# Altium project 18112C_Ticketing.PrjPcb
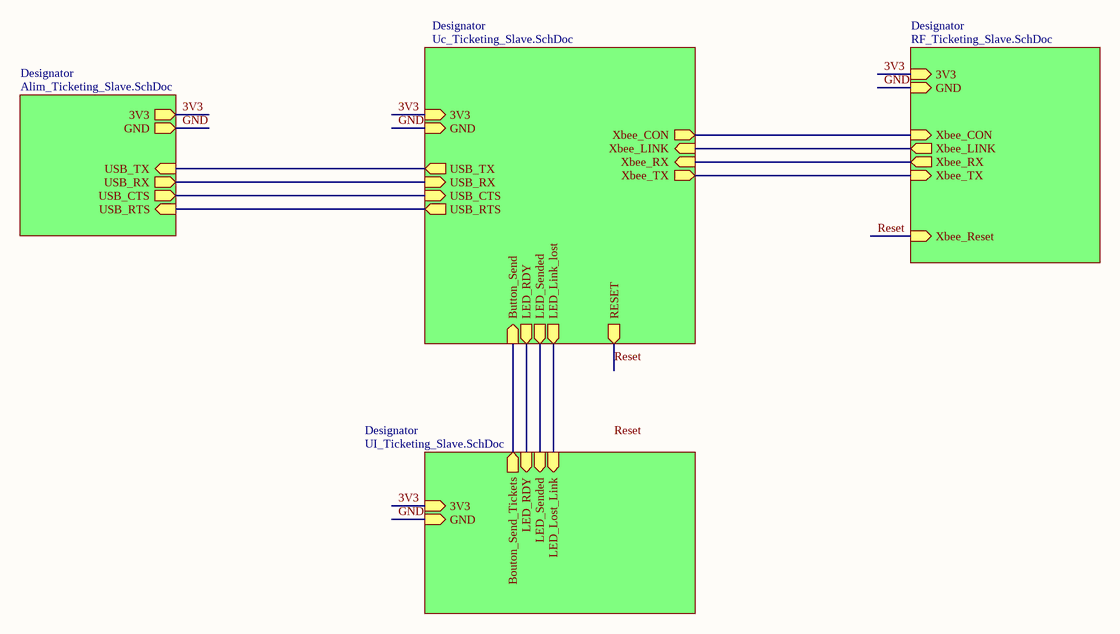
[diagram p0: Ticketing_Slave.SchDoc]
5 sheets, 49 parts. Net scope: hierarchical (ports join the sheet entries above them; power ports are global).
Board file: PCB_Ticketing_Slave_QFN.PcbDoc
Sheets:
  Ticketing_Slave.SchDoc
    Designator = Uc_Ticketing_Slave.SchDoc
    Designator = RF_Ticketing_Slave.SchDoc
    Designator = UI_Ticketing_Slave.SchDoc
    Designator = Alim_Ticketing_Slave.SchDoc

## Sheet Ticketing_Slave.SchDoc
size A4; Author: Mario Dos Santos; Organization: ETML-ES; Address1: Avenue Recordon 1; Address2: 1004 Lausanne; Address3: Switzerland; Revision: C; SheetNumber: 1; SheetTotal: 5

### Sub-sheets
Designator = Uc_Ticketing_Slave.SchDoc: 3V3 (in), GND (in), Xbee_CON (out), Xbee_LINK (in), Xbee_RX (in), Xbee_TX (out), Button_Send (in), LED_Link_lost (out), LED_Sended (out), LED_RDY (out), RESET (out), USB_TX (out), USB_RX (in), USB_CTS (in), USB_RTS (out)
Designator = RF_Ticketing_Slave.SchDoc: GND (in), Xbee_Reset (in), Xbee_CON (in), 3V3 (in), Xbee_LINK (out), Xbee_RX (out), Xbee_TX (in)
Designator = UI_Ticketing_Slave.SchDoc: 3V3 (in), GND (in), LED_RDY (in), LED_Sended (in), LED_Lost_Link (in), Bouton_Send_Tickets (out)
Designator = Alim_Ticketing_Slave.SchDoc: GND (out), 3V3 (out), USB_TX (in), USB_RX (out), USB_CTS (out), USB_RTS (in)

### Nets
3V3: sheet Designator/3V3, sheet Designator/GND, sheet Designator/LED_RDY, sheet Designator/RESET, sheet Designator/GND, sheet Designator/Xbee_Reset, sheet Designator/3V3, sheet Designator/3V3, sheet Designator/GND, sheet Designator/LED_RDY, sheet Designator/GND, sheet Designator/3V3  [also labelled GND, Reset]
Connect(M): sheet Designator/Xbee_TX, sheet Designator/Xbee_TX
LED_Lost: sheet Designator/Button_Send, sheet Designator/Bouton_Send_Tickets
LED_Send: sheet Designator/LED_Link_lost, sheet Designator/LED_Lost_Link
LINK(M): sheet Designator/Xbee_RX, sheet Designator/Xbee_RX
Reset: sheet Designator/LED_Sended, sheet Designator/LED_Sended
Reset(M): sheet Designator/Xbee_LINK, sheet Designator/Xbee_LINK
USB_CTS: sheet Designator/USB_CTS, sheet Designator/USB_CTS
USB_CTS: sheet Designator/USB_RTS, sheet Designator/USB_RTS  [a separate net that carries the same name]
USB_RX: sheet Designator/USB_RX, sheet Designator/USB_RX
USB_TX: sheet Designator/USB_TX, sheet Designator/USB_TX
Xbee_RX: sheet Designator/Xbee_CON, sheet Designator/Xbee_CON

### Notes on the sheet
- Labels drawn without touching a wire or pin: Reset
- Fichier :
- a
- Date :
- Heure :
- Version :
- Auteur :
- Modif.
- b
- c
- d
- Projet :
- No :
- Nb feuilles
- Feuille n°
- Chemin :

## Sheet Uc_Ticketing_Slave.SchDoc
size A4; Author: Mario Dos Santos; Organization: ETML-ES; Address1: Avenue Recordon 1; Address2: 1004 Lausanne; Address3: Switzerland; SheetNumber: 3; SheetTotal: 5
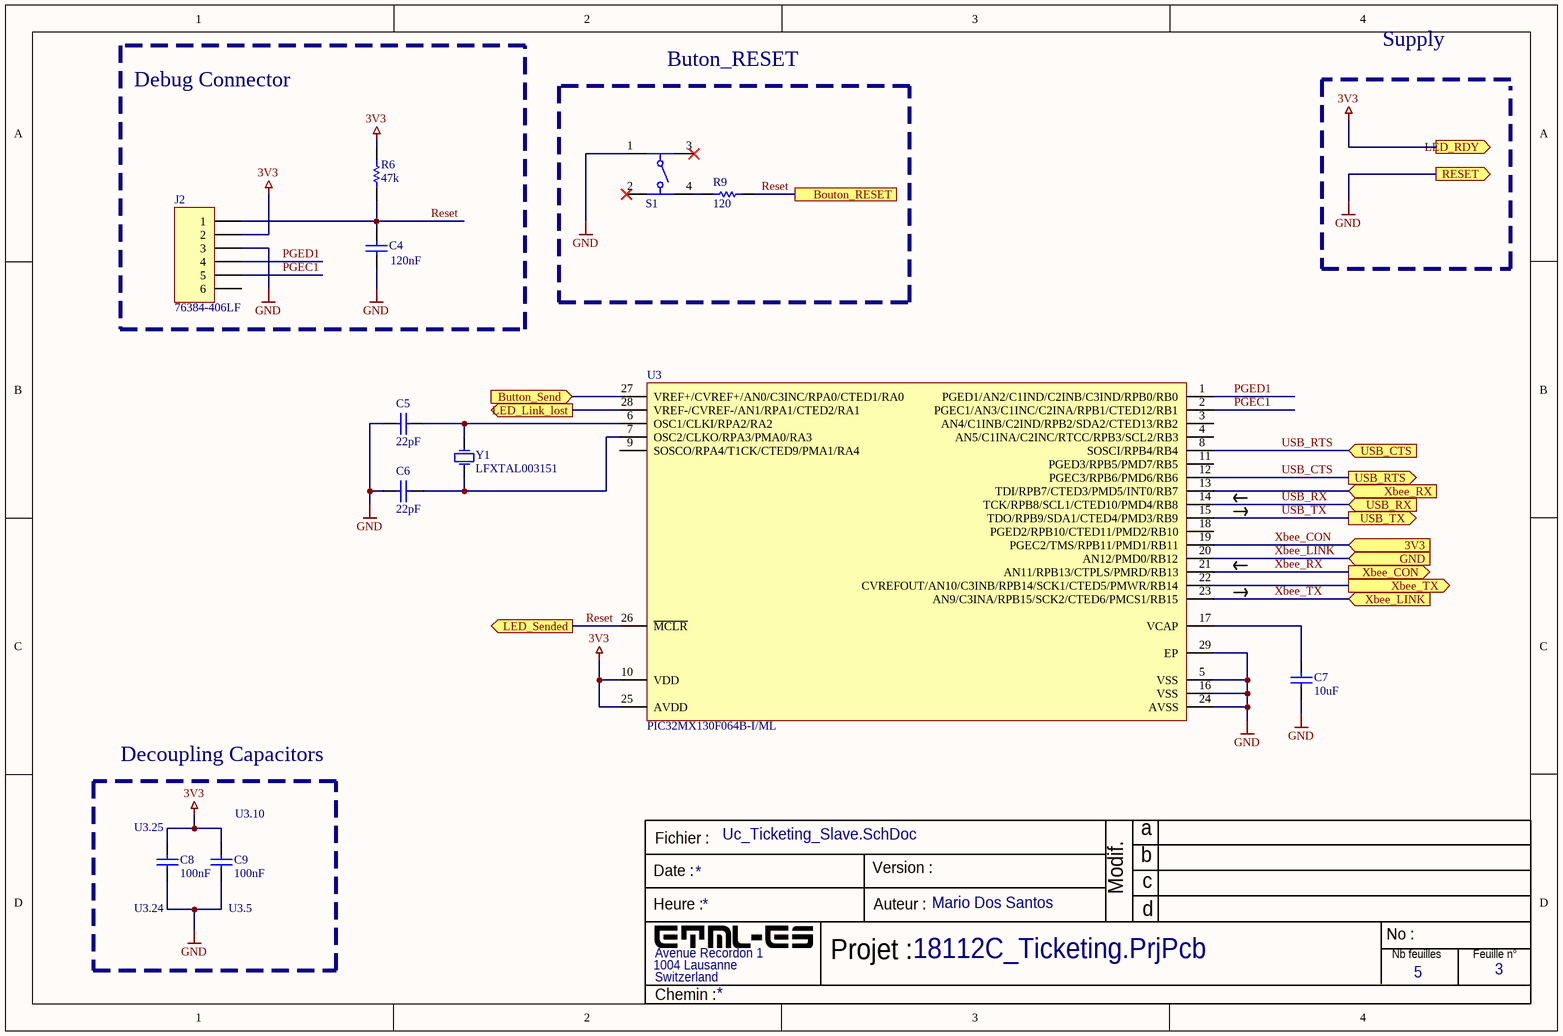
[diagram p1: Uc_Ticketing_Slave.SchDoc]

### Parts
C4  120nF  [6-0805_N]
C5  22pF  [6-0805_N]
C6  22pF  [6-0805_N]
C7  10uF  [6-0805_N]
C8  100nF  [6-0805_N]
C9  100nF  [6-0805_N]
J2  76384-406LF  [76384-406LF]
R6  47k  [RESC0805(2012)_L]
R9  120  [RESC0805(2012)_L]
S1  430182050816  [430182050816]  (value not drawn)
U3  PIC32MX130F064B-I/ML  [MCHP-QFN-ML28_L]
Y1  LFXTAL003151  [LFXTAL003151REEL]

### Blocks framed on the sheet
Debug Connector: C4 J2 R6
Buton_RESET: R9 S1
Decoupling Capacitors: C8 C9

### Ports
3V3 (in), Bouton_RESET, Button_Send (in), GND (in), LED_Link_lost (out), LED_RDY (out), LED_Sended (out), RESET (out), USB_CTS (in), USB_RTS (out), USB_RX (in), USB_TX (out), Xbee_CON (out), Xbee_LINK (in), Xbee_RX (in), Xbee_TX (out)

### Nets
3V3: C4.1 C5.1 C6.1 C7.1 C8.1 C8.2 C9.1 C9.2 J2.2 J2.3 R6.1 S1.1 U3.5(VSS) U3.10(VDD) U3.16(VSS) U3.19(PGEC2/TMS/RPB11/PMD1/RB11) U3.20(AN12/PMD0/RB12) U3.24(AVSS) U3.25(AVDD) U3.29(EP) ; port 3V3, port GND, port LED_RDY, port RESET  [also labelled GND, Xbee_CON, Xbee_LINK]
Connect(M): U3.22(CVREFOUT/AN10/C3INB/RPB14/SCK1/CTED5/PMWR/RB14) ; port Xbee_TX
LED_Lost: U3.27(VREF+/CVREF+/AN0/C3INC/RPA0/CTED1/RA0) ; port Button_Send
LED_Send: U3.28(VREF-/CVREF-/AN1/RPA1/CTED2/RA1) ; port LED_Link_lost
LINK(M): U3.13(TDI/RPB7/CTED3/PMD5/INT0/RB7) ; port Xbee_RX
PGEC1: J2.5 U3.2(PGEC1/AN3/C1INC/C2INA/RPB1/CTED12/RB1)
PGED1: J2.4 U3.1(PGED1/AN2/C1IND/C2INB/C3IND/RPB0/RB0)
Reset: C4.2 J2.1 R6.2 R9.2 U3.26(~{MCLR}) ; port LED_Sended, port Bouton_RESET
USB_CTS: U3.12(PGEC3/RPB6/PMD6/RB6) ; port USB_RTS
USB_RTS: U3.8(SOSCI/RPB4/RB4) ; port USB_CTS  [project net USB_CTS]
USB_RX: U3.14(TCK/RPB8/SCL1/CTED10/PMD4/RB8) ; port USB_RX
USB_TX: U3.15(TDO/RPB9/SDA1/CTED4/PMD3/RB9) ; port USB_TX
Xbee_RX: U3.21(AN11/RPB13/CTPLS/PMRD/RB13) ; port Xbee_CON
Xbee_TX: U3.23(AN9/C3INA/RPB15/SCK2/CTED6/PMCS1/RB15) ; port Xbee_LINK  [project net Reset(M)]
NetC5_2: C5.2 U3.6(OSC1/CLKI/RPA2/RA2) Y1.1
NetC6_2: C6.2 U3.7(OSC2/CLKO/RPA3/PMA0/RA3) Y1.2
NetC7_2: C7.2 U3.17(VCAP)
NetR9_1: R9.1 S1.4

Not connected (* = marked no-connect by the designer): J2 6; S1 2* 3*; U3 3(AN4/C1INB/C2IND/RPB2/SDA2/CTED13/RB2) 4(AN5/C1INA/C2INC/RTCC/RPB3/SCL2/RB3) 9(SOSCO/RPA4/T1CK/CTED9/PMA1/RA4) 11(PGED3/RPB5/PMD7/RB5) 18(PGED2/RPB10/CTED11/PMD2/RB10)

### Notes on the sheet
- Supply
- (near C8) U3.25
- (near C9) U3.10
- (near C8) U3.24
- (near C9) U3.5
- Fichier :
- a
- Date :
- Heure :
- Version :
- Auteur :
- Modif.
- b
- c
- d
- Projet :
- No :
- Nb feuilles
- Feuille n°
- Chemin :

### Library data of the parts
C4 C7-C9 = Cap: Capacitor; Supplier: Digi-Key
  C4: Value: 120nF; Supplier Part Number: 311-4323-1-ND; Supplier unit price: 0.18
  C7: Value: 10uF; Supplier Part Number: 1276-1298-1-ND; Supplier unit price: 0.1
  C8 C9: Value: 100nF; Supplier Part Number: 399-C0805C104M5RAC7800CT-ND; Supplier unit price: 0.1
C5 C6 = CMP-2007-03167-1: VJ0805Y104KNAAT; Supplier: Digi-Key; Supplier Part Number: 399-C0805C220J5GAC7800CT-ND; Supplier unit price: 0.1; Value: 22pF
J2 = Header 6: Header, 6-Pin; LatestRevisionDate: 17-Jul-2002; LatestRevisionNote: Re-released for DXP Platform.; Publisher: Altium Limited; Supplier 1: Digi-Key; Supplier Part Number 1: 609-1321-ND; Supplier unit price: 0.66; Value: 76384-406LF
R6 = CMP-1013-00122-1: 100K 0.125W 5% 0805 (2012 Metric)  SMD; Value: 47k; Supplier: Digi-Key; Supplier Part Number: A130144CT-ND; Supplier unit price: 0.1
R9 = CMP-1013-00122-1: 100K 0.125W 5% 0805 (2012 Metric)  SMD; Value: 10k; Supplier: Digi-Key; Supplier Part Number: A129738CT-ND; Supplier unit price: 0.1
S1 = 430182050816: 6x6mm SMD Tact Switch WS-TASV, height 5 mm, 160 gf; Supplier: Digi-Key; Supplier Part Number: 732-7005-1-ND; Supplier unit price: 0.51; Value: 430182050816
U3 = CMP-0048-00437-1: 32-bit Microcontroller with Audio and Graphics Interface, USB and Advanced Analog, 40 MHz, 21 I/O, PMP, -40 to 85 degC, 28-pin QFN (ML28), Tube; Supplier: Digi-Key; Supplier Part Number: PIC32MX130F064B-I/ML; Supplier unit price: 3.61; Value: PIC32MX130F064B-I/ML
Y1 = LFXTAL003151REEL: Crystal or Oscillator; Frequency: 8MHz; Supplier: Farnell; Supplier Part Number: 9713794; Supplier unit price: 0.392; Value: LFXTAL003151

## Sheet RF_Ticketing_Slave.SchDoc
size A4; Author: Mario Dos Santos; Organization: ETML-ES; Address1: Avenue Recordon 1; Address2: 1004 Lausanne; Address3: Switzerland; SheetNumber: 5; SheetTotal: 5
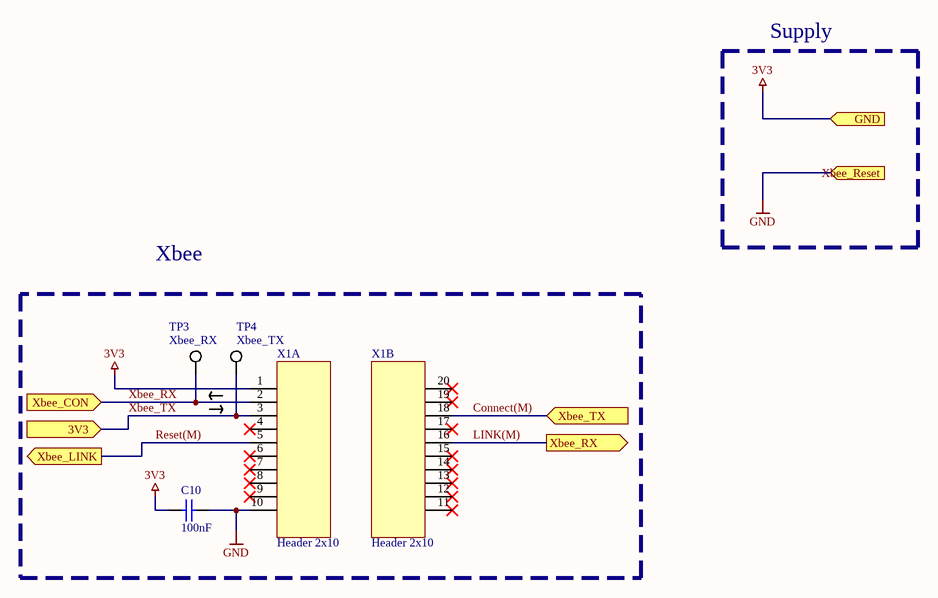
[diagram p2: RF_Ticketing_Slave.SchDoc]

### Parts
C10  100nF  [6-0805_N]
TP3  value Xbee_RX  [KSTN-5019_V]
TP4  value Xbee_TX  [KSTN-5019_V]
X1  Header 2x10  [ZB-SB]  (parts A,B of 2)

### Ports
3V3 (in), GND (in), Xbee_CON (in), Xbee_LINK (out), Xbee_Reset (in), Xbee_RX (out), Xbee_TX (in)

### Nets
3V3: C10.1 C10.2 TP4.1 X1.1 X1.3 X1.10 ; port GND, port Xbee_Reset, port 3V3  [also labelled GND, Xbee_TX]
Connect(M): X1.18 ; port Xbee_TX
LINK(M): X1.16 ; port Xbee_RX
Reset(M): X1.5 ; port Xbee_LINK
Xbee_RX: TP3.1 X1.2 ; port Xbee_CON

Not connected (* = marked no-connect by the designer): X1 4* 6* 7* 8* 9* 11* 12* 13* 14* 15* 17* 19* 20*

### Notes on the sheet
- Supply
- Xbee
- Fichier :
- a
- Date :
- Heure :
- Version :
- Auteur :
- Modif.
- b
- c
- d
- Projet :
- No :
- Nb feuilles
- Feuille n°
- Chemin :

### Library data of the parts
C10 = Cap_1: Capacitor; Value: 100nF; Supplier: Digi-Key; Supplier Part Number: 399-C0805C104M5RAC7800CT-ND; Supplier unit price: 0.1
TP3 TP4 = CMP-1672-00008-1: Test Point, 1 Position SMD, RoHS, Tape and Reel; Supplier: Digi-Key; Supplier Part Number: 36-5019CT-ND; Supplier unit price: 0.33
X1 = HDR ZB-SB 2x10_1: Header 2x10 / Xbee de letml(1623) ou xbee XB24CAUIT-001; Value: Header 2x10; Supplier: Digi-Key

## Sheet UI_Ticketing_Slave.SchDoc
size A4; Author: Mario Dos Santos; Organization: ETML-ES; Address1: Avenue Recordon 1; Address2: 1004 Lausanne; Address3: Switzerland; SheetNumber: 4; SheetTotal: 5
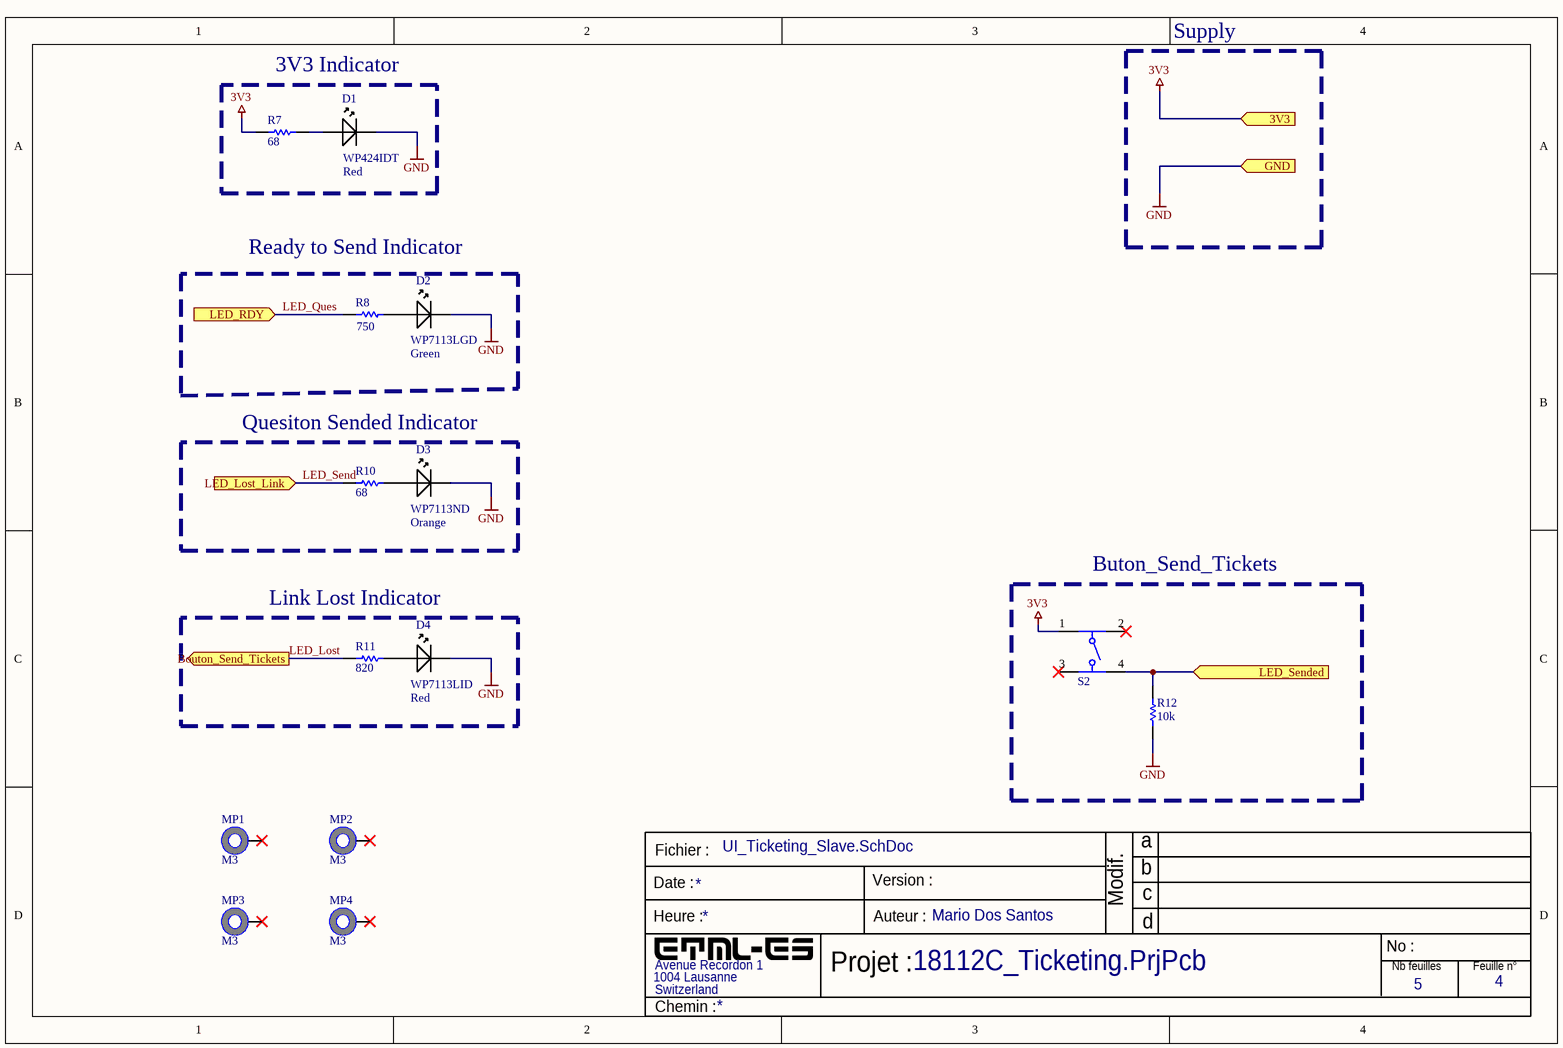
[diagram p3: UI_Ticketing_Slave.SchDoc]

### Parts
D1  WP424IDT  Color: Red  [LED-2P-2.28-3MM]
D2  WP7113LGD  Color: Green  [Type 5mm]
D3  WP7113ND  Color: Orange  [Type 5mm]
D4  WP7113LID  Color: Red  [Type 5mm]
MP1  M3  [9774010151]
MP2  M3  [9774010151]
MP3  M3  [9774010151]
MP4  M3  [9774010151]
R7  68  [RESC0805(2012)_L]
R8  750  [RESC0805(2012)_L]
R10  68  [RESC0805(2012)_L]
R11  820  [RESC0805(2012)_L]
R12  10k  [RESC0805(2012)_L]
S2  430466073726  [4304x60737x6_12x12x7.3]  (value not drawn)

### Blocks framed on the sheet
3V3 Indicator: D1 R7
Ready to Send Indicator: D2 R8
Quesiton Sended Indicator: D3 R10
Link Lost Indicator: D4 R11
Buton_Send_Tickets: R12 S2

### Ports
3V3 (in), Bouton_Send_Tickets (out), GND (in), LED_Lost_Link (in), LED_RDY (in), LED_Sended (in)

### Nets
3V3: D1.2(Cathode) D2.1(Cathode) D3.1(Cathode) D4.1(Cathode) R7.2 R8.2 R12.2 S2.1 ; port 3V3, port GND, port LED_RDY  [also labelled GND, LED_Ques]
LED_Lost: R11.2 ; port Bouton_Send_Tickets
LED_Send: R10.2 ; port LED_Lost_Link
Reset: R12.1 S2.4 ; port LED_Sended
NetD1_1: D1.1(Anode) R7.1
NetD2_2: D2.2(Anode) R8.1
NetD3_2: D3.2(Anode) R10.1
NetD4_2: D4.2(Anode) R11.1

Not connected (* = marked no-connect by the designer): MP1 1*; MP2 1*; MP3 1*; MP4 1*; S2 2* 3*

### Notes on the sheet
- Supply
- Fichier :
- a
- Date :
- Heure :
- Version :
- Auteur :
- Modif.
- b
- c
- d
- Projet :
- No :
- Nb feuilles
- Feuille n°
- Chemin :

### Library data of the parts
D1-D4 = LED: Supplier: Digi-Key
  D1: Supplier Part Number: 754-1305-ND; Supplier unit price: 0.4; Value: WP424IDT
  D2: Supplier Part Number: 754-1265-ND; Supplier unit price: 0.33; Value: WP7113LGD
  D3: Supplier Part Number: 754-1896-ND; Supplier unit price: 0.3; Value: WP7113ND
  D4: Supplier Part Number: 754-1266-ND; Supplier unit price: 0.33; Value: WP7113LID
MP1-MP4 = 9774010151: WA-SMSI SMT Steel Spacer, M2.5 Thread Internal, Length 1mm; Supplier: Digi-Key
R7 R8 R12 = CMP-1013-00122-1: 100K 0.125W 5% 0805 (2012 Metric)  SMD; Supplier: Digi-Key; Supplier unit price: 0.1
  R7: Value: 68; Supplier Part Number: RMCF0805JT68R0CT-ND
  R8: Value: 750; Supplier Part Number: A126386CT-ND
  R12: Value: 10k; Supplier Part Number: 311-10KLGCT-ND
R10 R11 = CMP-1013-00122-1: 100K 0.125W 5% 0805 (2012 Metric)  SMD; Value: 680; Supplier: Digi-Key; Supplier unit price: 0.1
  R10: Supplier Part Number: RMCF0805JT68R0CT-ND
  R11: Supplier Part Number: A129748CT-ND
S2 = 430466073726: WS-TATV 12x12mm washable Tact Switch, THT version; Supplier: Digi-Key; Supplier Part Number: 430466073726-ND; Supplier unit price: 0.56; Value: 430466073726

## Sheet Alim_Ticketing_Slave.SchDoc
size A4; Author: Mario Dos Santos; Organization: ETML-ES; Address1: Avenue Recordon 1; Address2: 1004 Lausanne; Address3: Switzerland; SheetNumber: 2; SheetTotal: 5
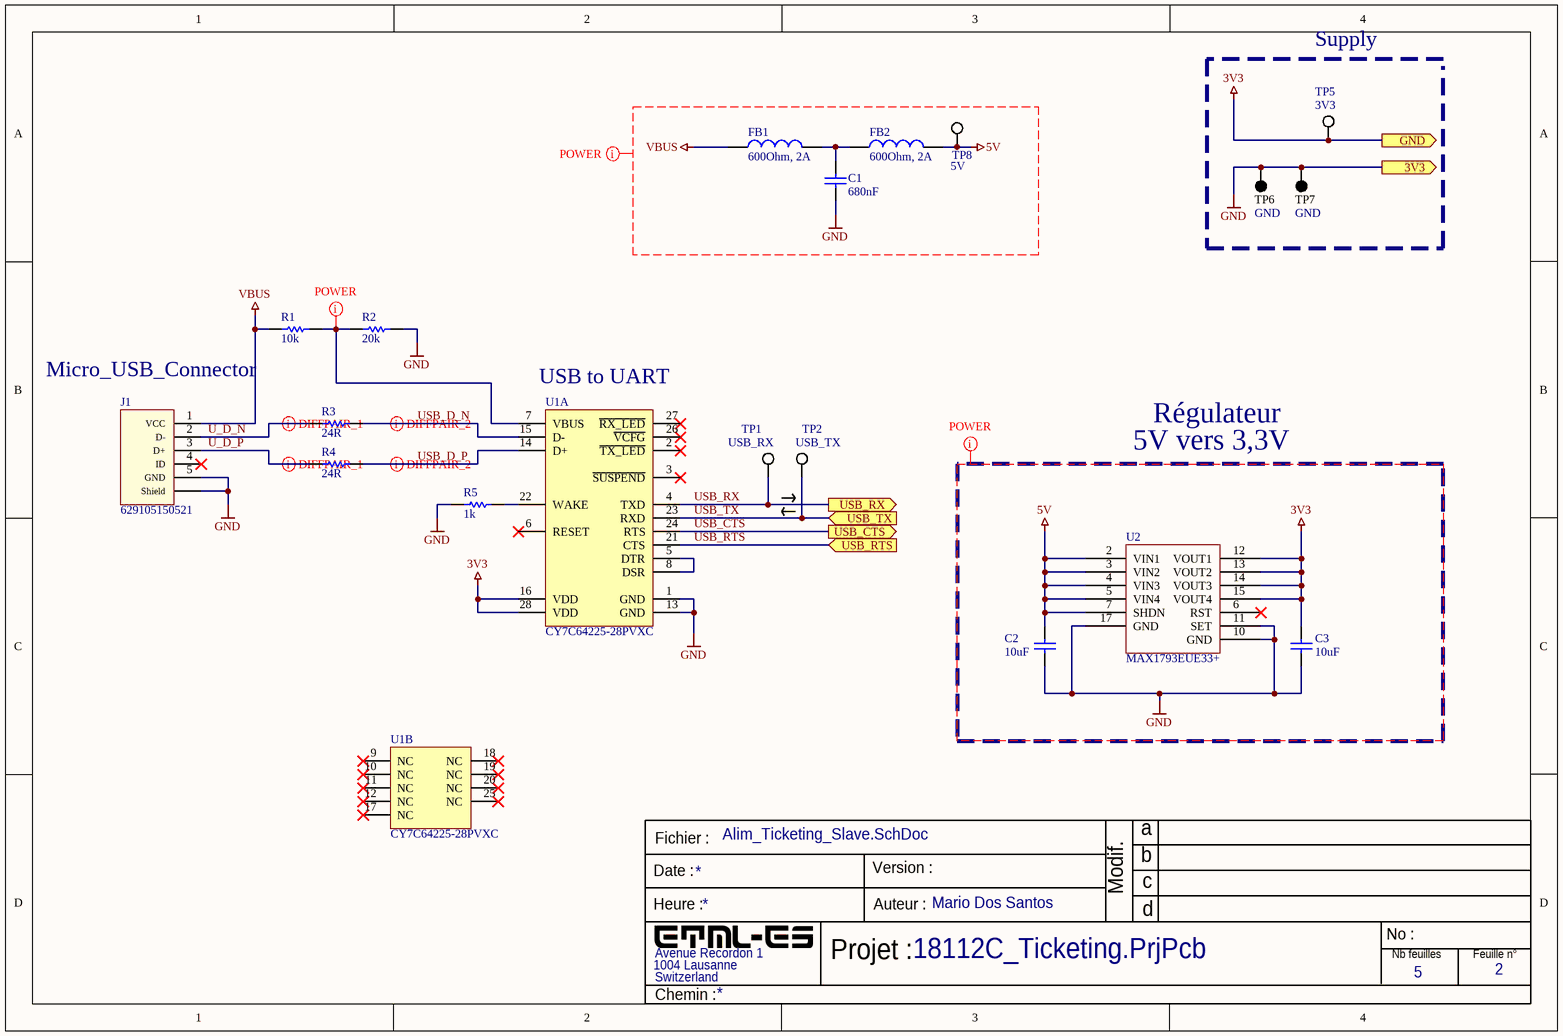
[diagram p4: Alim_Ticketing_Slave.SchDoc]

### Parts
C1  680nF  [6-0805_N]
C2  10uF  [6-0805_N]
C3  10uF  [6-0805_N]
FB1  600Ohm, 2A  [WE-CBF_0805_High Current]
FB2  600Ohm, 2A  [WE-CBF_0805_High Current]
J1  629105150521  [629105150521]
R1  10k  [RESC0805(2012)_L]
R2  20k  [RESC0805(2012)_L]
R3  24R  [RESC0805(2012)_L]
R4  24R  [RESC0805(2012)_L]
R5  1k  [RESC0805(2012)_L]
TP1  (no value)  [KSTN-5019_V]
TP2  (no value)  [KSTN-5019_V]
TP5  (no value)  [KSTN-5019_V]
TP6  (no value)  [KSTN-5011_V]
TP7  (no value)  [KSTN-5011_V]
TP8  (no value)  [KSTN-5019_V]
U1  CY7C64225-28PVXC  [CYP-PVX28_N]  (parts A,B of 2)
U2  MAX1793EUE33+  [TSOP65P640X110_HS-17N]

### Blocks framed on the sheet
5V vers 3,3V: C2 C3 U2

### Ports
3V3 (out), GND (out), USB_CTS (out), USB_RTS (in), USB_RX (out), USB_TX (in)

### Nets
3V3: C1.2 C2.2 C3.1 C3.2 J1.5(GND) J1.Shell(Shield) R2.2 R5.2 TP5.1 TP6.1 TP7.1 U1.1(GND) U1.13(GND) U1.16(VDD) U1.28(VDD) U2.10(GND) U2.11(SET) U2.12(VOUT1) U2.13(VOUT2) U2.14(VOUT3) U2.15(VOUT4) U2.17(GND) ; port GND, port 3V3  [also labelled GND]
5V: C2.1 FB2.2 TP8.1 U2.2(VIN1) U2.3(VIN2) U2.4(VIN3) U2.5(VIN4) U2.7(SHDN)
VBUS: FB1.1 J1.1(VCC) R1.1
U_D_N: J1.2(D-) R3.1
U_D_P: J1.3(D+) R4.1
USB_CTS: U1.24(RTS) ; port USB_CTS
USB_D_N: R3.2 U1.15(D-)
USB_D_P: R4.2 U1.14(D+)
USB_RTS: U1.21(CTS) ; port USB_RTS  [project net USB_CTS]
USB_RX: TP1.1 U1.4(TXD) ; port USB_RX
USB_TX: TP2.1 U1.23(RXD) ; port USB_TX
NetC1_1: C1.1 FB1.2 FB2.1
NetR1_2: R1.2 R2.1 U1.7(VBUS)
NetR5_1: R5.1 U1.22(WAKE)
NetU1_5: U1.5(DTR) U1.8(DSR)

Not connected (* = marked no-connect by the designer): J1 4(ID)*; U1 2(~{TX_LED})* 3(~{SUSPEND})* 6(RESET)* 9(NC)* 10(NC)* 11(NC)* 12(NC)* 17(NC)* 18(NC)* 19(NC)* 20(NC)* 25(NC)* 26(~{VCFG})* 27(~{RX_LED})*; U2 6(RST)*

### Layout directives
differential pair: U_D_N, U_D_P, USB_D_N, USB_D_P
net class POWER: 3V3, 5V, GND, NetR1_2, VBUS

### Notes on the sheet
- Supply
- (near TP5) 3V3
- 5V
- GND
- Micro_USB_Connector
- (near U1) USB to UART
- (near TP1) USB_RX
- (near TP2) USB_TX
- Régulateur
- Fichier :
- a
- Date :
- Heure :
- Version :
- Auteur :
- Modif.
- b
- c
- d
- Projet :
- No :
- Nb feuilles
- Feuille n°
- Chemin :

### Library data of the parts
C1 = 885012207098: WCAP-CSGP General Purpose Ceramic Capacitors, size 0805, 100nF, +/-10%, 50VDC; Technical Reference: X7R0805104K050DFCT10000; Capacitance: 680nF; Supplier Part Number 1: 732-7663-1-ND; Value: 680nF; Supplier unit price: 0.13; Supplier: Digi-Key; Supplier Part Number: 732-7663-1-ND
C2 C3 = Cap: Capacitor; Published: 8-Jun-2000; LatestRevisionDate: 17-Jul-2002; LatestRevisionNote: Re-released for DXP Platform.; PackageReference: RAD-0.3; Publisher: Altium Limited; PackageDescription: Radial Cap, Thru-Hole; 2 Leads; 0.3 in Pin Spacing; Value: 10uF; Capacitance: 10uF; Supplier Part Number: 1276-1298-1-ND; Supplier unit price: 0.1; Supplier: Digi-Key
FB1 FB2 = 742792040: WE-CBF SMT EMI Suppression Ferrite Bead, size 0805, 600Ohm, 2A; Impedance max.: 700Ohm; DC Resistance max.: 0.15Ohm; Type: High Current; ComponentLink1Description: Manufacturer; ComponentLink1URL: http://www.we-online.de; ComponentLink2Description: Datasheet; ComponentLink2URL: https://katalog.we-online.com/pbs/datasheet/742792040.pdf; Part Number: 742792040; Published Date: March 2019; Publisher: Wurth Elektronik; Rated Current: 2A; Operating Temperature: -55 to +125degC; Impedance@100 MHz: 600Ohm; Mounting Technology: SMT; Packaging: Tape and Reel; Size: 0805; Supplier Part Number 1: 732-1620-1-ND; Supplier unit price: 0.22; Supplier: Digi-Key; Value: 600Ohm, 2A; Supplier Part Number: 732-1620-1-ND
J1 = 629105150521: Micro USB 2.0 SMT Type B Horizontal 5 Contacts High Current WR-COM; Part Number: 732-5960-1-ND; Interface Type: Type B; Gender: Receptacle; ComponentLink1Description: Manufacturer; ComponentLink1URL: http://www.we-online.de; ComponentLink2Description: Datasheet; ComponentLink2URL: http://katalog.we-online.de/em/datasheet/629105150521.pdf; Published Date: April 2017; Publisher: Wurth Elektronik; Sub-Family: Micro USB 2.0; Type: Horizontal; Construction: SMT; Value: 629105150521; Supplier: Digi-key; Supplier Part Number: 732-5960-1-ND; Supplier unit price: 2.12
R1-R5 = CMP-1013-00122-1: 100K 0.125W 5% 0805 (2012 Metric)  SMD; Case-Metric: 2012; Case-EIA: 0805; Tolerance: 5 %; Technology: SMT; Power: 0.125 W; Supplier: Digi-Key; Supplier unit price: 0.1
  R1: Value: 10k; Supplier Part Number: 311-10KLGCT-ND
  R2: Value: 20k; Supplier Part Number: RNCP0805FTD20K0CT-ND
  R3 R4: Value: 24R; Supplier Part Number: 311-24.0CRCT-ND
  R5: Value: 1k; Supplier Part Number: RNCP0805FTD1K00CT-ND
TP1 TP2 TP5 TP8 = CMP-1672-00008-1: as TP3 on sheet RF_Ticketing_Slave; ComponentLink1Description: Manufacturer URL; Package Quantity: 1000; DatasheetVersion: 03/2014; Packaging: Tape and Reel; ComponentLink2URL: http://www.keyelco.com/product-pdf.cfm?p=1357; ComponentLink1URL: http://www.keyelco.com/; Mount: Surface Mount; Contact Plating: Silver; PackageDescription: 1-Pin Surface Mount Device, Body 3.81 x 2.03 mm; Pins: 1; RoHSCompliant: True; Mounting Technology: Surface Mount; ComponentLink2Description: Datasheet; PackageReference: 5019; Supplier: Digi-Key; Supplier Part Number: 36-5019CT-ND; Supplier unit price: 0.33
TP6 TP7 = CMP-1672-00003-4: Test Point, Black, Through Hole, RoHS, Bulk,5011; Manufacturer: Keystone; ComponentLink2URL: http://www.keyelco.com/product-pdf.cfm?p=1320; Colour: Black; Pins: 1; REACH SVHC: No SVHC; ComponentLink1URL: http://www.keyelco.com/; PackageReference: 5011; Contact Plating: Silver; Package Quantity: 100; Packaging: Bulk; RoHSCompliant: true; Height: 8.12 mm; PackageDescription: 1-Pin Through Hole Device, Dia 3.17 mm; Mount: Through Hole; Mounting Technology: Through Hole; DatasheetVersion: Rev. F, 12/2013; ComponentLink1Description: Manufacturer URL; Contact Material: Bronze; ComponentLink2Description: Datasheet
U1 = CMP-0967-00143-1: USB-to-UART Bridge Controller, 3 to 5.25 V, 0 to 70 degC, 28-Pin SSOP (PVX28), Tube; Manufacturer: Cypress; Part Number: 428-3158-ND; Max. Operating Voltage (V): 5.25; Min. Operating Voltage (V): 3; Memory Architecture: Flash; Mounting Technology: Surface Mount; Max. Operating Temp. (degreesC): 70; DatasheetVersion: Rev. *D; Packing: Tube; ComponentLink2URL: http://www.cypress.com/?docID=48153; PackageReference: PVX28; PartNumber: CY7C64225-28PVXC; PackageDescription: 28-Pin Super Small Outline Package, Body 10.2 x 5.3 mm, Pitch 0.65 mm; RoHS: Pb-Free; ComponentLink3Description: Package Specification; Min. Operating Temp. (degreesC): 0; ComponentLink1URL: http://www.cypress.com/; ComponentLink2Description: Datasheet; ComponentLink1Description: Manufacturer URL; PackageVersion: Rev. *C, 10/2001; ComponentLink3URL: http://www.cypress.com/?docID=1371; Manufacturer Part Number: CY7C64225-28PVXC; Value: CY7C64225-28PVXC; Supplier: Digi-key; Supplier Part Number: 428-3158-ND; Supplier unit price: 3.83
U2 = MAX1793: Supplier Part Number: MAX1793EUE33+-ND; Supplier unit price: 3.92; Value: MAX1793EUE33+; Supplier: Digi-Key

## Nets that join several sheets
3V3: Uc_Ticketing_Slave (20 pins), RF_Ticketing_Slave (6 pins), UI_Ticketing_Slave (8 pins), Alim_Ticketing_Slave (22 pins)
Connect(M): Uc_Ticketing_Slave (U3.22), RF_Ticketing_Slave (X1.18)
LED_Lost: Uc_Ticketing_Slave (U3.27), UI_Ticketing_Slave (R11.2)
LED_Send: Uc_Ticketing_Slave (U3.28), UI_Ticketing_Slave (R10.2)
LINK(M): Uc_Ticketing_Slave (U3.13), RF_Ticketing_Slave (X1.16)
Reset: Uc_Ticketing_Slave (5 pins), UI_Ticketing_Slave (R12.1 S2.4)
Reset(M): Uc_Ticketing_Slave (U3.23), RF_Ticketing_Slave (X1.5)
USB_CTS: Uc_Ticketing_Slave (U3.8), Alim_Ticketing_Slave (U1.24)
USB_CTS: Uc_Ticketing_Slave (U3.12), Alim_Ticketing_Slave (U1.21)
USB_RX: Uc_Ticketing_Slave (U3.14), Alim_Ticketing_Slave (TP1.1 U1.4)
USB_TX: Uc_Ticketing_Slave (U3.15), Alim_Ticketing_Slave (TP2.1 U1.23)
Xbee_RX: Uc_Ticketing_Slave (U3.21), RF_Ticketing_Slave (TP3.1 X1.2)